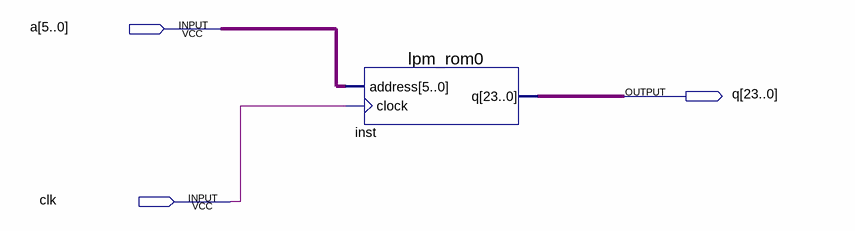
[diagram p0: schematic sheet]
// Quartus schematic Block1.bdf as structural Verilog: 1 symbols, 3 pins
module Block1 (
  input  [5:0] a,
  input  clk,
  output [23:0] q
);

  lpm_rom0 inst (.address(a), .clock(clk), .q(q));
endmodule
